# Altium schematic sheet Rangefinders.SchDoc
size A4; SheetNumber: 9; SheetTotal: 11
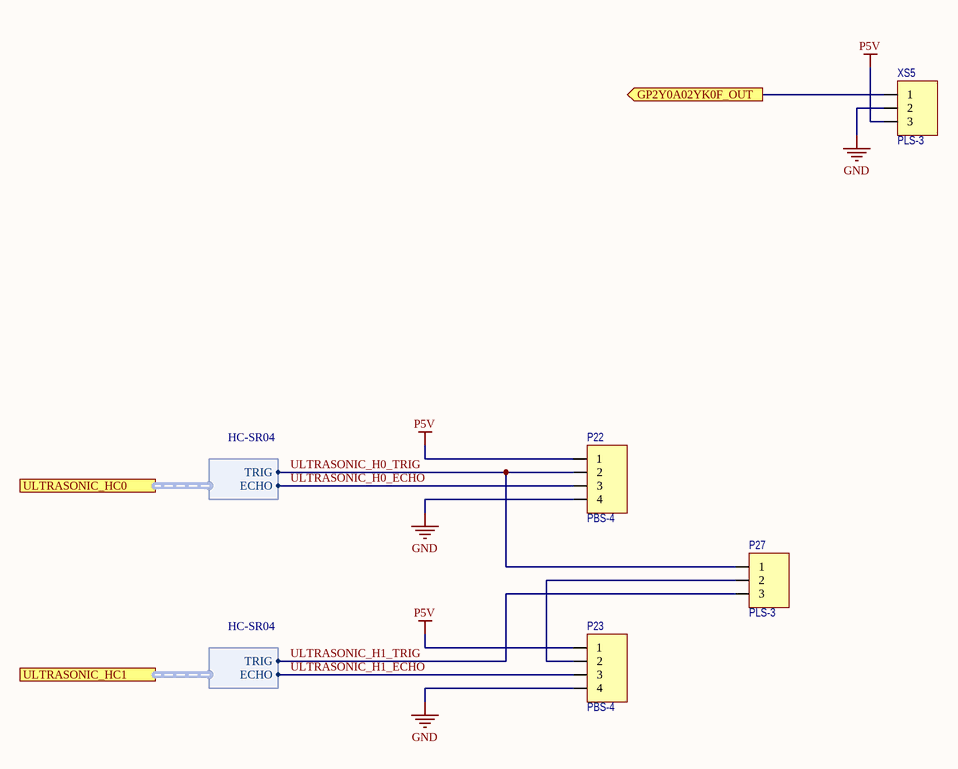
[diagram p0: Rangefinders.SchDoc]

## Parts
P22  PBS-4  [PBS-4]
P23  PBS-4  [PBS-4]
P27  PLS-3  [PLS-3]
XS5  PLS-3  [PBS2-3]

## Ports
GP2Y0A02YK0F_OUT (out), ULTRASONIC_HC0 (harness HC-SR04), ULTRASONIC_HC1 (harness HC-SR04)

## Harnesses
HC-SR04: ECHO, TRIG

## Nets
GND: P22.4 P23.4 XS5.2
P5V: P22.1 P23.1 XS5.3
GP2Y0A02YK0F_OUT: XS5.1 ; port GP2Y0A02YK0F_OUT
ULTRASONIC_H0_ECHO: P22.3 ; port ULTRASONIC_HC0.ECHO
ULTRASONIC_H0_TRIG: P22.2 P27.1 ; port ULTRASONIC_HC0.TRIG
ULTRASONIC_H1_ECHO: P23.3 ; port ULTRASONIC_HC1.ECHO
ULTRASONIC_H1_TRIG: P27.3 ; port ULTRASONIC_HC1.TRIG
NetP23_2: P23.2 P27.2

## Library data of the parts
XS5 = PBS2-3